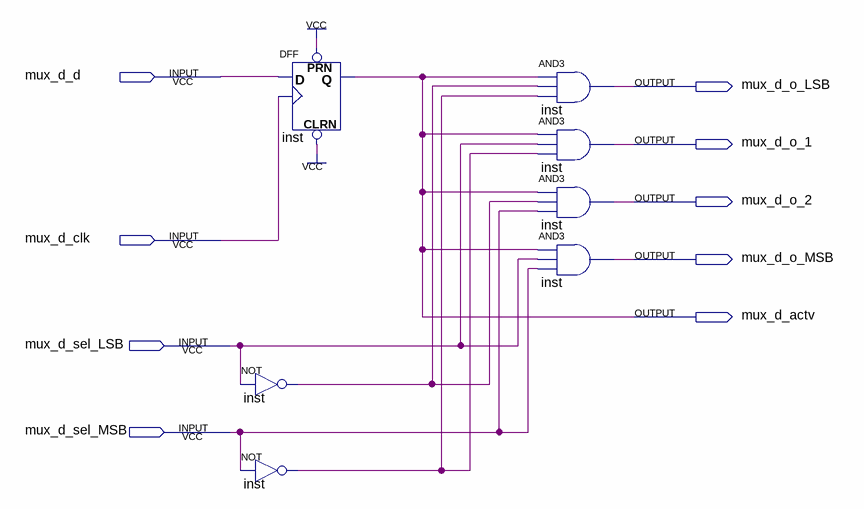
[diagram p0: schematic sheet]
// Quartus schematic mux_d.bdf as structural Verilog: 7 symbols, 9 pins
module mux_d (
  input  mux_d_d,
  input  mux_d_clk,
  input  mux_d_sel_LSB,
  input  mux_d_sel_MSB,
  output mux_d_o_LSB,
  output mux_d_o_1,
  output mux_d_o_2,
  output mux_d_o_MSB,
  output mux_d_actv
);

  wire inst_out, inst_out_2;

  not inst (inst_out_2, mux_d_sel_LSB);
  not inst_dup2 (inst_out, mux_d_sel_MSB);
  DFF inst_dup3 (.CLRN(1'b1), .CLK(mux_d_clk), .D(mux_d_d), .PRN(1'b1), .Q(mux_d_actv));
  and inst_dup4 (mux_d_o_LSB, mux_d_actv, inst_out_2, inst_out);
  and inst_dup5 (mux_d_o_1, mux_d_actv, mux_d_sel_LSB, inst_out);
  and inst_dup6 (mux_d_o_2, mux_d_actv, inst_out_2, mux_d_sel_MSB);
  and inst_dup7 (mux_d_o_MSB, mux_d_actv, mux_d_sel_LSB, mux_d_sel_MSB);
endmodule
